# EAGLE design LightingUPS_v2b (EAGLE 7.5.0)
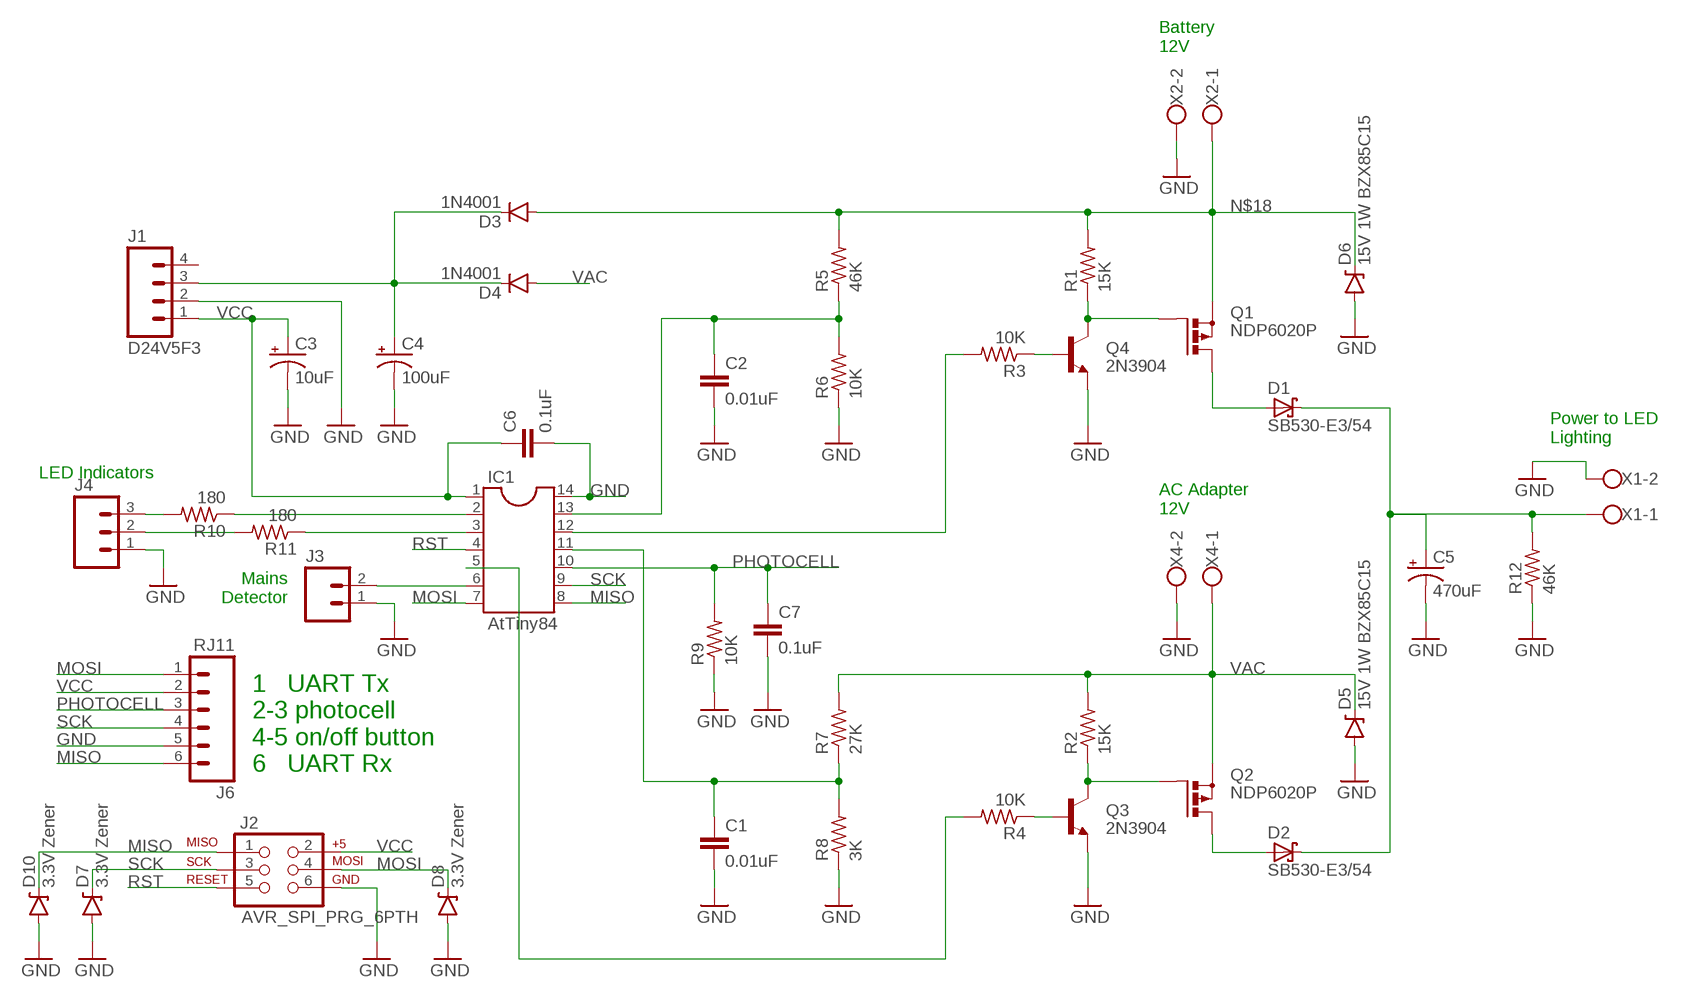
[diagram p0: schematic, sheet 1]

## Parts
C1  0.01uF  CAPPTH1  [CAP-PTH-5MM]
C2  0.01uF  CAPPTH1  [CAP-PTH-5MM]
C3  10uF  CAP_POLPTH1  [CPOL-RADIAL-100UF-25V]
C4  100uF  CAP_POLPTH1  [CPOL-RADIAL-100UF-25V]
C5  470uF  CAP_POLPTH4  [CPOL-RADIAL-1000UF-25V]
C6  0.1uF  CAPPTH  [CAP-PTH-SMALL]
C7  0.1uF  CAPPTH  [CAP-PTH-SMALL]
D1  SB530-E3/54  SCHOTTKY-DIODEDO201T15  [DO201T15]
D2  SB530-E3/54  SCHOTTKY-DIODEDO201T15  [DO201T15]
D3  1N4001  DIODEPTH  [DIODE-1N4001]
D4  1N4001  DIODEPTH  [DIODE-1N4001]
D5  15V 1W BZX85C15  DIODE-ZENERPTH  [DIODE-ZENER]
D6  15V 1W BZX85C15  DIODE-ZENERPTH  [DIODE-ZENER]
D7  3.3V Zener  DIODE-ZENERPTH  [DIODE-ZENER]
D8  3.3V Zener  DIODE-ZENERPTH  [DIODE-ZENER]
D10  3.3V Zener  DIODE-ZENERPTH  [DIODE-ZENER]
IC1  AtTiny84  DIL14  [DIL14]
J1  D24V5F3  M04PTH  [1X04]
J2  AVR_SPI_PRG_6PTH  [2X3]
J3  M02PTH  [1X02]
J4  M03PTH  [1X03]
J6  RJ11  RJ11-6PTH  [RJ11-6]
Q1  NDP6020P  PMOSFET_PTO220BV  [TO220BV]
Q2  NDP6020P  PMOSFET_PTO220BV  [TO220BV]
Q3  2N3904  TRANSISTOR_NPNTO-92-AMMO  [TO-92-AMMO]
Q4  2N3904  TRANSISTOR_NPNTO-92-AMMO  [TO-92-AMMO]
R1  15K  R-US_0204/5  [0204/5]
R2  15K  R-US_0204/5  [0204/5]
R3  10K  R-US_0204/5  [0204/5]
R4  10K  R-US_0204/5  [0204/5]
R5  46K  R-US_0204/5  [0204/5]
R6  10K  R-US_0204/5  [0204/5]
R7  27K  R-US_0204/5  [0204/5]
R8  3K  R-US_0204/5  [0204/5]
R9  10K  R-US_0204/5  [0204/5]
R10  180  R-US_0204/5  [0204/5]
R11  180  R-US_0204/5  [0204/5]
R12  46K  R-US_0204/5  [0204/5]
X1  W237-102  [W237-102]
X2  W237-102  [W237-102]
X4  W237-102  [W237-102]

## Nets
GND: C1.2 C2.2 C3.2(-) C4.2(-) C5.- C6.2 C7.2 D5.P$2(A) D6.P$2(A) D7.P$2(A) D8.P$2(A) D10.P$2(A) IC1.14 J1.2 J2.6 J3.1 J4.1 J6.5 Q3.1(E) Q4.1(E) R6.1 R8.1 R9.1 R12.1 X1.2 X2.2 X4.2
MISO: D10.P$1(C) IC1.8 J2.1 J6.6
MOSI: D8.P$1(C) IC1.7 J2.4 J6.1
N$1: J4.3 R10.2
N$2: Q1.G Q4.3(C) R1.1
N$3: Q4.2(B) R3.1
N$4: D1.A Q1.D
N$5: C5.+ D1.C D2.C R12.2 X1.1
N$6: C2.1 IC1.13 R5.1 R6.2
N$7: IC1.6 J3.2
N$8: C1.1 IC1.11 R7.1 R8.2
N$9: Q2.G Q3.3(C) R2.1
N$10: Q3.2(B) R4.1
N$11: D2.A Q2.D
N$12: IC1.12 R3.2
N$13: C4.1(+) D3.C D4.C J1.3
N$14: IC1.5 R4.2
N$15: IC1.2 R10.1
N$16: IC1.3 R11.1
N$17: J4.2 R11.2
N$18: D3.A D6.P$1(C) Q1.S R1.2 R5.2 X2.1
PHOTOCELL: C7.1 IC1.10 J6.3 R9.2
RST: IC1.4 J2.5
SCK: D7.P$1(C) IC1.9 J2.3 J6.4
VAC: D4.A D5.P$1(C) Q2.S R2.2 R7.2 X4.1
VCC: C3.1(+) C6.1 IC1.1 J1.1 J2.2 J6.2
Unconnected: J1.4

## Notes on the sheet
- Battery
  12V
- Power to LED
  Lighting
- LED Indicators
- AC Adapter
  12V
- Mains
  Detector
- 1   UART Tx
  2-3 photocell
  4-5 on/off button
  6   UART Rx

## Library data of the parts
C1 C2 = SparkFun-Passives:CAP: Capacitor Standard 0603 ceramic capacitor, and 0.1" leaded capacitor.
C3-C5 = SparkFun-Capacitors:CAP_POL: Capacitor Polarized These are standard SMD and PTH capacitors. Normally 10uF, 47uF, and 100uF in electrolytic and tantalum varieties. Always verify the external diameter of the through hole cap, it varies with capacity, voltage, and manufacturer. The EIA devices should be standard.
C6 C7 = SparkFun-Capacitors:CAP: Capacitor Standard 0603 ceramic capacitor, and 0.1" leaded capacitor.
D1 D2 = adafruit:SCHOTTKY-DIODE: Schottky Diode
D3 D4 = SparkFun-DiscreteSemi:DIODE: Diode These are standard reverse protection diodes and small signal diodes. SMA package can handle up to about 1A. SOD-323 can handle about 200mA. What the SOD-323 package when ordering, there are some mfgs out there that are 5-pin packages.
D5-D8 D10 = SparkFun-DiscreteSemi:DIODE-ZENER: Zener Diode Production Part - 8199 3.4V Zener Voltage
IC1 = ic-package:DIL14: Dual In Line / Socket
J1 = SparkFun-Connectors:M04: Header 4 Standard 4-pin 0.1" header. Use with straight break away headers (SKU : PRT-00116), right angle break away headers (PRT-00553), swiss pins (PRT-00743), machine pins (PRT-00117), and female headers (PRT-00115). Molex polarized connector foot print use with SKU : PRT-08231 with associated crimp pins and housings. 1MM SMD Version SKU: PRT-10208; PROD_ID: CONN-09696
J2 = SparkFun-Connectors:AVR_SPI_PRG_6: AVR ISP 6 Pin This is the reduced ISP connector for AVR programming. Common on Arduino. This footprint will take up less PCB space and can be used with a 10-pin to 6-pin adapter such as SKU: BOB-08508 **Special note about "TEST_POINT" package. The stop mask is on the top side, so if you want your programming test points to be on the bottom of your board, make sure to place this package on the bottom side of the board. This also ensure that the orientation to program from the bottom side will be correct.
J3 = SparkFun-Connectors:M02: Standard 2-pin 0.1" header. Use with - straight break away headers ( PRT-00116) - right angle break away headers (PRT-00553) - swiss pins (PRT-00743) - machine pins (PRT-00117) - female headers (PRT-00115) Molex polarized connector foot print use with: PRT-08233 with associated crimp pins and housings. 2.54_SCREWTERM for use with PRT-10571. 3.5mm Screw Terminal footprints for PRT-08084 5mm Screw Terminal footprints for use with PRT-08432
J4 = SparkFun-Connectors:M03: Header 3 Standard 3-pin 0.1" header. Use with straight break away headers (SKU : PRT-00116), right angle break away headers (PRT-00553), swiss pins (PRT-00743), machine pins (PRT-00117), and female headers (PRT-00115). Molex polarized connector foot print use with SKU : PRT-08232 with associated crimp pins and housings.
J6 = SparkFun-Connectors:RJ11-6: RJ11 Jack Simple 6 pin RJ11 jack. Commonly found on CAT3 devices and Microchip programmers. SKU: PRT-00132; PROD_ID: CONN-08590
Q1 Q2 = transistor-power:PMOSFET_P: Power MOSFET P-Channel
Q3 Q4 = SparkFun-DiscreteSemi:TRANSISTOR_NPN: Generic NPN BJT MMBT2222A - TRANS-08049 (SOT-23, 1A 40V) MPSA42 - TRANS-09116 (SOT-23, 500mA 300V) MMBT5088LT1G - TRANS-11160 (SOT-23, 50 mA 30V) BC547 - COM-08928 <http://www.sparkfun.com/products/8928> (TO-92 45V 100mA) (1.Collector 2.Base 3.Emitter) 2N3904 - COM-00521 <http://www.sparkfun.com/products/521> (TO-92 40V 200mA) (1.Emitter 2.Base 3.Collector) P2N2222A - COM-12852 <http://www.sparkfun.com/products/12852> (TO-92 40V 600mA) (1.Collector 2.Base 3.Emitter)
R1-R12 = resistor:R-US_: RESISTOR, American symbol
X1 X2 X4 = con-wago-500:W237-102: WAGO SCREW CLAMP; MPN: 237-102; OC_FARNELL: unknown; OC_NEWARK: 70K9898

## Board
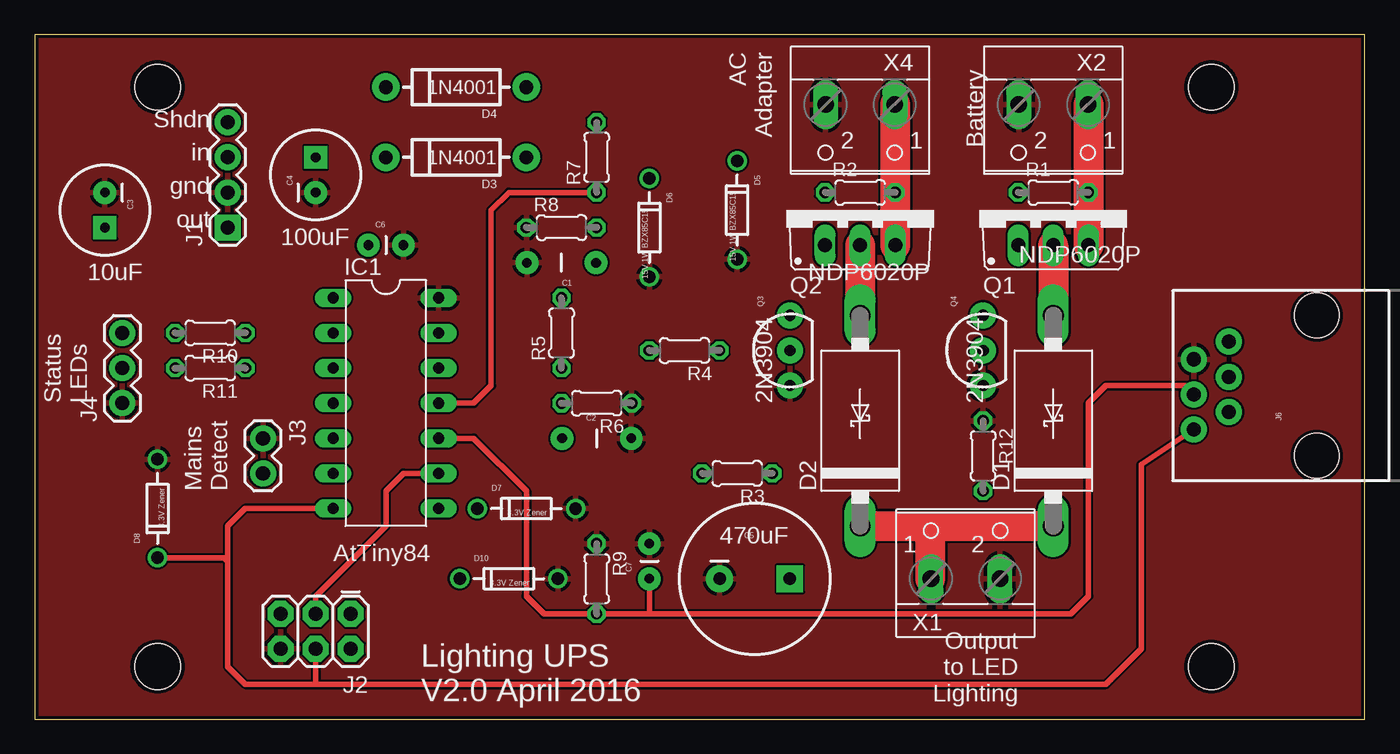
[diagram p1: board, top side]
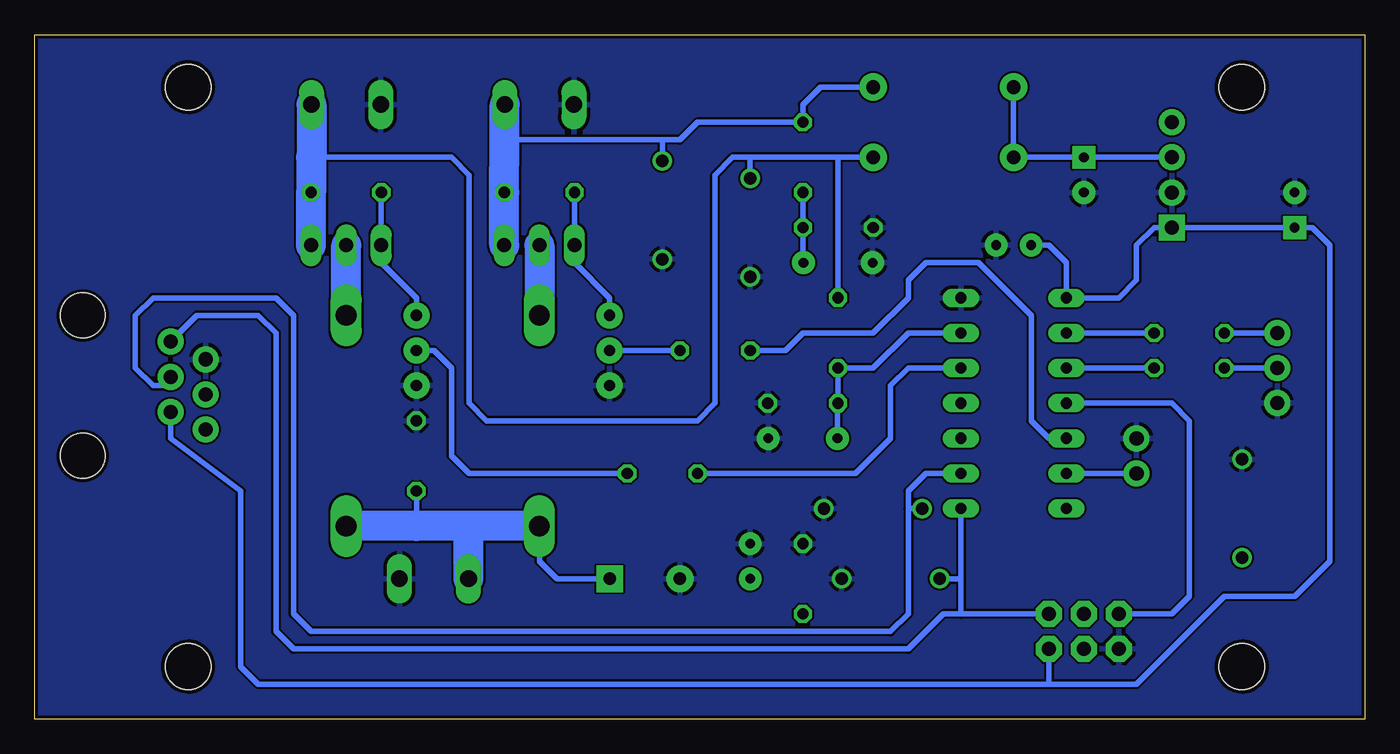
[diagram p2: board, bottom side, seen from below]

Size 96.19 x 49.52 mm. Coordinates in mm from the lower left corner, seen from the top.
Outline: 0,0 96.19,0 96.19,49.52 0,49.52 0,0
Copper layers (1*16): Top 0.035mm / dielectric 1.5mm / Bottom 0.035mm
Design rules "SeeedStudio_2layer_DRU_no_angle_20140221": minimum track width 6mil, minimum drill 12mil, track to track 6mil, track to pad 6mil, pad to pad 6mil, via to via 6mil, smd to smd 0mil, copper to edge 10mil, drill to drill 10mil, minimum pad ring 10mil, minimum via ring 6mil, stop-mask expansion 2mil, vias tented up to drill 100mil, thermal gap 10mil

### Footprints (pad centres in the part's own frame; a part is rotated, then mirrored left to right if it is on the bottom)
CAP-PTH-5MM = drill 0.7 pad 1.651: 1 -2.5,0; 2 2.5,0
CPOL-RADIAL-100UF-25V = drill 0.7 pad 1.651 square: 1 1.27,0 | drill 0.7 pad 1.651: 2 -1.27,0
CPOL-RADIAL-1000UF-25V = drill 0.9 pad 1.93 square: + 2.54,0 | drill 0.9 pad 1.93: - -2.54,0
CAP-PTH-SMALL = drill 0.7 pad 1.651: 1 0,0; 2 2.54,0
DO201T15 = drill 1.499 long: A 7.62,0; C -7.62,0
DIODE-1N4001 = drill 1 pad 1.981: A -5.08,0; C 5.08,0
DIODE-ZENER = drill 0.9: P$1 -3.556,0; P$2 3.556,0
DIL14 = drill 0.813 long: 1 -7.62,-3.81; 2 -5.08,-3.81; 3 -2.54,-3.81; 4 0,-3.81; 5 2.54,-3.81; 6 5.08,-3.81; 7 7.62,-3.81; 8 7.62,3.81; 9 5.08,3.81; 10 2.54,3.81; 11 0,3.81; 12 -2.54,3.81; 13 -5.08,3.81; 14 -7.62,3.81
1X04 = drill 1.016 pad 1.88 square: 1 0,0 | drill 1.016 pad 1.88: 2 2.54,0; 3 5.08,0; 4 7.62,0
2X3 = drill 1.016 pad 1.88 octagon: 1 0,0; 2 0,2.54; 3 2.54,0; 4 2.54,2.54; 5 5.08,0; 6 5.08,2.54
1X02 = drill 1.016 pad 1.88: 1 0,0; 2 2.54,0
1X03 = drill 1.016 pad 1.88: 1 0,0; 2 2.54,0; 3 5.08,0
RJ11-6 = drill 1.016 pad 1.88: 1 -3.175,8.89; 2 -1.905,6.35; 3 -0.635,8.89; 4 0.635,6.35; 5 1.905,8.89; 6 3.175,6.35 | hole 3.251: -5.08,0; 5.08,0
TO220BV = drill 1.016 long: D 0,-2.54; G -2.54,-2.54; S 2.54,-2.54
TO-92-AMMO = drill 0.813 pad 1.88: 1 -2.54,0; 2 0,0; 3 2.54,0
0204/5 = drill 0.813 octagon: 1 -2.54,0; 2 2.54,0
STAND-OFF = hole 3.302: 0,0
W237-102 = drill 1.194 long: 1 -2.5,-1.27; 2 2.5,-1.27

### Placement (x,y rotation side)
C1  38.1,33.02 180 top
C2  40.64,20.32 0 top
C3  5.08,36.83 270 top
C4  20.32,39.37 90 top
C5  52.07,10.16 0 top
C6  24.13,34.29 0 top
C7  44.45,10.16 90 top
D1  73.66,21.59 90 top
D2  59.69,21.59 90 top
D3  30.48,40.64 180 top
D4  30.48,45.72 180 top
D5  50.8,36.83 270 top
D6  44.45,35.56 270 top
D7  35.56,15.24 0 top
D8  8.89,15.24 90 top
D10  34.29,10.16 0 top
IC1  25.4,22.86 270 top
J1  13.97,35.56 90 top
J2  22.86,7.62 180 top
J3  16.51,20.32 270 top
J4  6.35,22.86 90 top
J6  92.71,24.13 90 top
Q1  73.66,36.83 0 top
Q2  59.69,36.83 0 top
Q3  54.61,26.67 90 top
Q4  68.58,26.67 90 top
R1  73.66,38.1 0 top
R2  59.69,38.1 0 top
R3  50.8,17.78 180 top
R4  46.99,26.67 180 top
R5  38.1,27.94 90 top
R6  40.64,22.86 180 top
R7  40.64,40.64 90 top
R8  38.1,35.56 0 top
R9  40.64,10.16 270 top
R10  12.7,27.94 180 top
R11  12.7,25.4 180 top
R12  68.58,19.05 270 top
U$1  [STAND-OFF]  8.89,3.81 0 top
U$2  [STAND-OFF]  85.09,3.81 0 top
U$3  [STAND-OFF]  8.89,45.72 0 top
U$4  [STAND-OFF]  85.09,45.72 0 top
X1  67.31,11.43 0 top
X2  73.66,43.18 180 top
X4  59.69,43.18 180 top

### Tracks (layer width: path | path; a pad name or v marks a point on that pad's centre or on a via)
GND
  pour Bottom: 0,0 0,49.53 96.52,49.53 96.52,0
  pour Top: 0,0 0,49.53 96.52,49.53 96.52,0
MISO
  Bottom 0.406: J2.1 29.21,7.62 | 29.21,7.62 30.48,7.62 33.02,5.08 77.47,5.08 78.74,6.35 78.74,27.94 80.01,29.21 84.45,29.21 J6.6 | IC1.8 29.21,10.16 | 29.21,10.16 29.21,7.62 | D10.P$1 29.21,10.16
MOSI
  Top 0.406: IC1.7 15.24,15.24 13.97,13.97 13.97,11.43 | 13.97,11.43 13.97,3.81 15.24,2.54 20.32,2.54 | 20.32,2.54 77.47,2.54 80.01,5.08 80.01,18.41 J6.1 | J2.4 20.32,2.54 | D8.P$1 13.72,11.68 13.97,11.43
N$1
  Bottom 0.406: J4.3 R10.2
N$2
  Bottom 0.406: R1.1 Q1.G 71.12,33.02 68.58,30.48 Q4.3
N$3
  Bottom 0.406: R3.1 64.77,17.78 66.04,19.05 66.04,25.4 67.31,26.67 Q4.2
N$4
  Top 2.184: Q1.D D1.A
  Bottom 2.184: D1.A Q1.D
N$5
  Top 2.184: D2.C 64.77,13.97 | 64.77,13.97 D1.C | 64.77,10.16 64.77,13.97
  Bottom 0.406: C5.+ 58.42,10.16 59.69,11.43 D2.C | R12.2 68.58,13.97
  Bottom 2.184: D2.C 64.77,13.97 | 64.77,13.97 68.58,13.97 D1.C | X1.1 64.81,13.93 64.77,13.97
N$6
  Bottom 0.406: C2.1 38.14,22.86 R6.2 R5.1 35.56,25.4 33.02,27.94 IC1.13
N$7
  Bottom 0.406: IC1.6 J3.2
N$8
  Top 0.406: IC1.11 31.75,22.86 33.02,24.13 33.02,36.83 34.29,38.1 R7.1
  Bottom 0.406: R7.1 R8.2 40.64,33.12 arc-45 C1.1 arc-45 40.64,32.92
N$9
  Bottom 0.406: Q3.3 54.61,30.48 57.15,33.02 Q2.G R2.1
N$10
  Bottom 0.406: R4.1 Q3.2
N$11
  Top 2.184: Q2.D D2.A
  Bottom 2.184: Q2.D D2.A
N$12
  Bottom 0.406: IC1.12 33.02,25.4 34.29,24.13 34.29,20.32 36.83,17.78 R3.2
N$13
  Bottom 0.406: J1.3 C4.1 D3.C D4.C
N$14
  Bottom 0.406: IC1.5 22.86,20.32 24.13,21.59 24.13,29.21 27.94,33.02 31.75,33.02 33.02,31.75 33.02,30.48 35.56,27.94 40.64,27.94 41.91,26.67 R4.2
N$15
  Bottom 0.406: IC1.2 R10.1
N$16
  Bottom 0.406: IC1.3 R11.1
N$17
  Bottom 0.406: J4.2 R11.2
N$18
  Top 2.184: 76.2,44.45 R1.2 Q1.S
  Bottom 0.406: D3.A 38.1,40.64 | 38.1,40.64 44.45,40.64 | 44.45,40.64 45.72,40.64 46.99,39.37 46.99,22.86 48.26,21.59 63.5,21.59 64.77,22.86 64.77,39.37 66.04,40.64 76.16,40.64 | R5.2 38.1,40.64 | D6.P$1 44.45,40.64
  Bottom 2.184: Q1.S R1.2 76.2,40.64 76.16,40.64 X2.1
PHOTOCELL
  Top 0.406: IC1.10 31.75,20.32 35.56,16.51 35.56,8.89 36.83,7.62 R9.2 44.45,7.62 | 44.45,7.62 74.93,7.62 76.2,8.89 76.2,22.86 77.47,24.13 83.19,24.13 J6.3 | C7.1 44.45,7.62
RST
  Bottom 0.406: IC1.4 13.97,22.86 12.7,21.59 12.7,8.89 13.97,7.62 J2.5
SCK
  Top 0.406: J2.3 20.32,8.89 25.4,13.97 25.4,16.51 26.67,17.78 IC1.9
  Bottom 0.406: IC1.9 31.75,17.78 33.02,16.51 33.02,15.24 | 33.02,15.24 33.02,7.62 34.29,6.35 76.2,6.35 77.47,7.62 77.47,29.21 78.74,30.48 87.63,30.48 88.9,29.21 88.9,25.4 87.63,24.13 87,24.13 J6.4 | D7.P$1 33.02,15.24
VAC
  Top 2.184: Q2.S 62.23,44.45
  Bottom 0.406: D4.A 39.37,45.72 40.64,44.45 R7.2 48.26,43.18 49.53,41.91 50.8,41.91 | 50.8,41.91 62.21,41.92 | D5.P$1 50.8,41.91
  Bottom 2.184: Q2.S R2.2 62.21,41.92 X4.1
VCC
  Bottom 0.406: C6.1 22.86,34.29 21.59,33.02 IC1.1 17.78,30.48 16.51,31.75 16.51,34.29 15.24,35.56 J1.1 C3.1 3.81,35.56 2.54,34.29 2.54,11.43 5.08,8.89 10.16,8.89 16.51,2.54 22.86,2.54 | J2.2 22.86,2.54 | 22.86,2.54 80.01,2.54 81.28,3.81 81.28,16.51 86.36,20.32 J6.2

### Text on the board
tPlace: AC / Adapter | Battery | Shdn / in / gnd / out | 100uF | NDP6020P | NDP6020P | 10uF | Status / LEDs | 2N3904 | 2N3904 | Mains / Detect | AtTiny84 | 470uF | Lighting UPS / V2.0 April 2016 | Output / to LED / Lighting